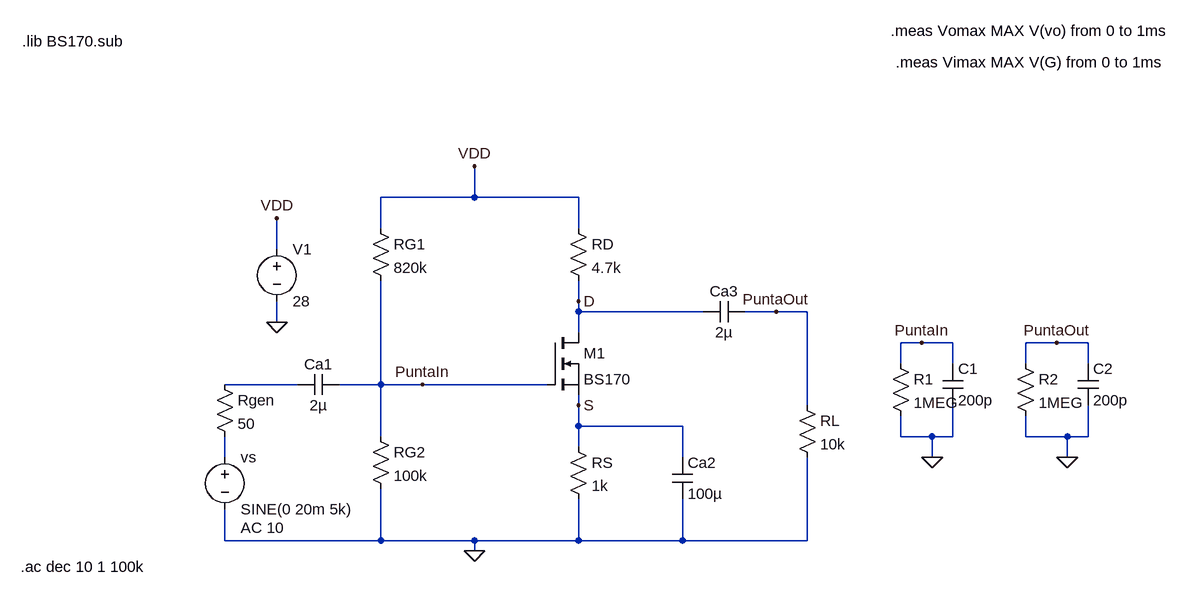
[diagram p0: schematic A.asc]
A.asc, the LTspice schematic file:
Version 4
SHEET 1 1732 696
WIRE 432 0 432 -48
WIRE 432 0 288 0
WIRE 592 0 432 0
WIRE 288 48 288 0
WIRE 592 48 592 0
WIRE 128 80 128 32
WIRE 592 160 592 128
WIRE 592 176 592 160
WIRE 784 176 592 176
WIRE 896 176 848 176
WIRE 944 176 896 176
WIRE 128 192 128 160
WIRE 592 208 592 176
WIRE 1120 224 1088 224
WIRE 1168 224 1120 224
WIRE 1328 224 1280 224
WIRE 1376 224 1328 224
WIRE 1088 256 1088 224
WIRE 1168 256 1168 224
WIRE 1280 256 1280 224
WIRE 1376 256 1376 224
WIRE 160 288 48 288
WIRE 288 288 288 128
WIRE 288 288 224 288
WIRE 352 288 288 288
WIRE 544 288 352 288
WIRE 592 320 592 304
WIRE 944 320 944 176
WIRE 592 352 592 320
WIRE 752 352 592 352
WIRE 288 368 288 288
WIRE 1088 368 1088 336
WIRE 1136 368 1088 368
WIRE 1168 368 1168 320
WIRE 1168 368 1136 368
WIRE 1280 368 1280 336
WIRE 1344 368 1280 368
WIRE 1376 368 1376 320
WIRE 1376 368 1344 368
WIRE 592 384 592 352
WIRE 48 400 48 368
WIRE 752 400 752 352
WIRE 1136 400 1136 368
WIRE 1344 400 1344 368
WIRE 48 528 48 480
WIRE 288 528 288 448
WIRE 288 528 48 528
WIRE 432 528 288 528
WIRE 592 528 592 464
WIRE 592 528 432 528
WIRE 752 528 752 464
WIRE 752 528 592 528
WIRE 944 528 944 400
WIRE 944 528 752 528
WIRE 432 544 432 528
FLAG 432 -48 VDD
FLAG 128 192 0
FLAG 128 32 VDD
FLAG 432 544 0
FLAG 592 160 D
FLAG 592 320 S
FLAG 1344 400 0
FLAG 1136 400 0
FLAG 1120 224 PuntaIn
FLAG 1328 224 PuntaOut
FLAG 896 176 PuntaOut
FLAG 352 288 PuntaIn
SYMBOL res 576 32 R0
SYMATTR InstName RD
SYMATTR Value 4.7k
SYMBOL res 272 32 R0
SYMATTR InstName RG1
SYMATTR Value 820k
SYMBOL res 272 352 R0
SYMATTR InstName RG2
SYMATTR Value 100k
SYMBOL res 576 368 R0
SYMATTR InstName RS
SYMATTR Value 1k
SYMBOL nmos 544 208 R0
SYMATTR InstName M1
SYMATTR Value BS170
SYMBOL voltage 128 64 R0
WINDOW 123 0 0 Left 2
WINDOW 39 0 0 Left 2
SYMATTR InstName V1
SYMATTR Value 28
SYMBOL cap 736 400 R0
SYMATTR InstName Ca2
SYMATTR Value 100µ
SYMBOL cap 848 160 R90
WINDOW 0 0 32 VBottom 2
WINDOW 3 32 32 VTop 2
SYMATTR InstName Ca3
SYMATTR Value 2µ
SYMBOL res 928 304 R0
SYMATTR InstName RL
SYMATTR Value 10k
SYMBOL res 32 272 R0
SYMATTR InstName Rgen
SYMATTR Value 50
SYMBOL voltage 48 384 R0
WINDOW 123 24 124 Left 2
WINDOW 39 0 0 Left 2
SYMATTR Value2 AC 10
SYMATTR InstName vs
SYMATTR Value SINE(0 20m 5k)
SYMBOL cap 224 272 R90
WINDOW 0 0 32 VBottom 2
WINDOW 3 32 32 VTop 2
SYMATTR InstName Ca1
SYMATTR Value 2µ
SYMBOL res 1072 240 R0
SYMATTR InstName R1
SYMATTR Value 1MEG
SYMBOL cap 1152 256 R0
SYMATTR InstName C1
SYMATTR Value 200p
SYMBOL res 1264 240 R0
SYMATTR InstName R2
SYMATTR Value 1MEG
SYMBOL cap 1360 256 R0
SYMATTR InstName C2
SYMATTR Value 200p
TEXT -264 -240 Left 2 !.lib BS170.sub
TEXT 1072 -256 Left 2 !.meas Vomax MAX V(vo) from 0 to 1ms
TEXT 1080 -208 Left 2 !.meas Vimax MAX V(G) from 0 to 1ms
TEXT -266 568 Left 2 !.ac dec 10 1 100k

The netlist it stands for:
* A.asc
RD VDD D 4.7k
RG1 VDD PuntaIn 820k
RG2 PuntaIn 0 100k
RS S 0 1k
M1 D PuntaIn S S BS170
V1 VDD 0 28
Ca2 S 0 100µ
Ca3 PuntaOut D 2µ
RL PuntaOut 0 10k
Rgen N001 N002 50
vs N002 0 SINE(0 20m 5k) AC 10
Ca1 PuntaIn N001 2µ
R1 PuntaIn 0 1MEG
C1 PuntaIn 0 200p
R2 PuntaOut 0 1MEG
C2 PuntaOut 0 200p
.model NMOS NMOS
.model PMOS PMOS
.lib standard.mos
.lib BS170.sub
.meas Vomax MAX V(vo) from 0 to 1ms
.meas Vimax MAX V(G) from 0 to 1ms
.ac dec 10 1 100k
.backanno
.end